# Altium project Inv_Pen_PCB.PrjPcb
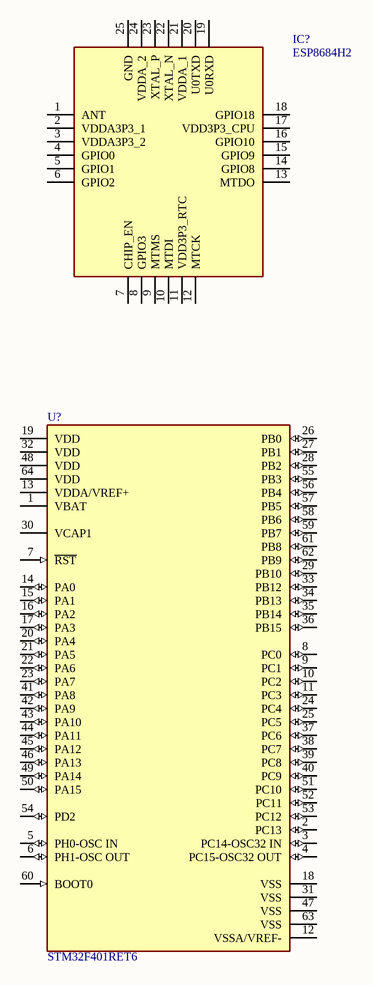
[diagram p0: Inv_Pen_Schaltplan.SchDoc]
1 sheet, 2 parts. Net scope: global (net labels, ports and power ports of the same name join across sheets).

## Sheet Inv_Pen_Schaltplan.SchDoc
size A3; SheetNumber: 1; SheetTotal: 1

### Parts
IC?  ESP8684H2  [QFN50P400X400X90-25N]
U?  STM32F401RET6  [FP-LQFP64-5W-MFG]

### Nets

Not connected (* = marked no-connect by the designer): IC? 1(ANT) 2(VDDA3P3_1) 3(VDDA3P3_2) 4(GPIO0) 5(GPIO1) 6(GPIO2) 7(CHIP_EN) 8(GPIO3) 9(MTMS) 10(MTDI) 11(VDD3P3_RTC) 12(MTCK) 13(MTDO) 14(GPIO8) 15(GPIO9) 16(GPIO10) 17(VDD3P3_CPU) 18(GPIO18) 19(U0RXD) 20(U0TXD) 21(VDDA_1) 22(XTAL_N) 23(XTAL_P) 24(VDDA_2) 25(GND); U? 1(VBAT) 2(PC13) 3(PC14-OSC32_IN) 4(PC15-OSC32_OUT) 5(PH0-OSC_IN) 6(PH1-OSC_OUT) 7(~{RST}) 8(PC0) 9(PC1) 10(PC2) 11(PC3) 12(VSSA/VREF-) 13(VDDA/VREF+) 14(PA0) 15(PA1) 16(PA2) 17(PA3) 18(VSS) 19(VDD) 20(PA4) 21(PA5) 22(PA6) 23(PA7) 24(PC4) 25(PC5) 26(PB0) 27(PB1) 28(PB2) 29(PB10) 30(VCAP1) 31(VSS) 32(VDD) 33(PB12) 34(PB13) 35(PB14) 36(PB15) 37(PC6) 38(PC7) 39(PC8) 40(PC9) 41(PA8) 42(PA9) 43(PA10) 44(PA11) 45(PA12) 46(PA13) 47(VSS) 48(VDD) 49(PA14) 50(PA15) 51(PC10) 52(PC11) 53(PC12) 54(PD2) 55(PB3) 56(PB4) 57(PB5) 58(PB6) 59(PB7) 60(BOOT0) 61(PB8) 62(PB9) 63(VSS) 64(VDD)

### Library data of the parts
IC? = ESP8684H2: Integrated Circuit; Manufacturer_Name: Espressif Systems; Datasheet Link: https://www.espressif.com/sites/default/files/documentation/esp8684_datasheet_en.pdf; Height: 0.9mm; Manufacturer_Part_Number: ESP8684H2; Mouser Part Number: 356-ESP8684H2; Mouser Price/Stock: https://www.mouser.co.uk/ProductDetail/Espressif-Systems/ESP8684H2?qs=tlsG%2FOw5FFihttp5U5w1zA%3D%3D
U? = CMP-12105-000004-1: IC MCU 32BIT 512KB FLASH 64LQFP; Manufacturer: STMicroelectronics; Memory Size: 512KBytes; Number Of Cores: 1; Max Junction Temp: +105°C; Ram Size: 96KBytes; Number Of Adc Channels: 12; Number Of Pwm Channels: 23; Standoff Height: 0.05mm; Frequency: 84MHz; Description: ARM® Cortex®-M4 STM32F4 Microcontroller IC 32-Bit 84MHz 512KB (512K x 8) FLASH 64-LQFP (10x10); Number Of Timers/Counters: 8; Number Of I/Os: 50; Interface: I2C,SPI,USART,USB,IrDA,I2S,SMBus,Other; Number Of I2C Channels: 3; Max Supply Voltage: 3.6V; Data Bus Width: 32bits; Core Architecture: ARM Cortex-M4; Min Supply Voltage: 1.65V; Category: IC; Device Class L3: Microcontrollers; ComponentLink2URL: https://www.st.com/resource/en/datasheet/stm32f401re.pdf; RoHS: TRUE; Temperature Range High: +105°C; Device Class L2: Embedded Processors and Controllers; ComponentLink2Description: Datasheet; Temperature Range Low: -40°C; Digikey Description: IC MCU 32BIT 512KB FLASH 64LQFP; Package: LQFP64-5W; Manufacturer Part Number: STM32F401RET6; Number Of A/D Converters: 1; Ipc Land Pattern Name: QFP50P1200X1200X160-64; Automotive: No; Ambient Temperature Range Low: -40°C; Height: 1.6mm; Octopart: https://octopart.com/stm32f401ret6-stmicroelectronics-34185993; Ambient Temperature Range High: +85°C; Device Class L1: Integrated Circuits (ICs); Temperature: -40°C to +105°C; Number Of Spi Channels: 3; Number Of Uart Channels: 3; Memory Type: FLASH; Number Of Usb Channels: 1; Lead Free: Yes; Mouser Description: ARM Microcontrollers - MCU 16/32-BITS MICROS